# Altium schematic sheet coverSheet.SchDoc
size 431 x 279 mm; Date: Not shown in title block; ApprovedBy: Not shown in title block; CheckedBy: Not shown in title block; Author: Not shown in title block; CompanyName: Not shown in title block; Engineer: Not shown in title block; Organization: Not shown in title block; Address1: Not shown in title block; Address2: Not shown in title block; Address3: Not shown in title block; Address4: Not shown in title block; DocumentNumber: 1; Revision: Use project parameter SCH_Rev; SheetNumber: 1; SheetTotal: 3; PageSetup: Record=PageOptions|CenterHorizontal=True|CenterVertical=True|PrintScale=1.00|XCorrection=1.00|YCorrection=1.00|PrintKind=0|BorderSize=5000000|LeftOffset=0|BottomOffset=0|Orientation=2|PaperLength=1000|PaperWidth=1000|Scale=100|PaperSource=15|PrintQuality=600|MediaType=1|DitherType=10|PaperKind=Letter|PrintScaleMode=1; CurrentTime: Not shown in title block; CurrentDate: Not shown in title block; Time: Not shown in title block; DocumentFullPathAndName: Not shown in title block; DocumentName: Not shown in title block; ModifiedDate: Not shown in title block; ImagePath: Not shown in title block
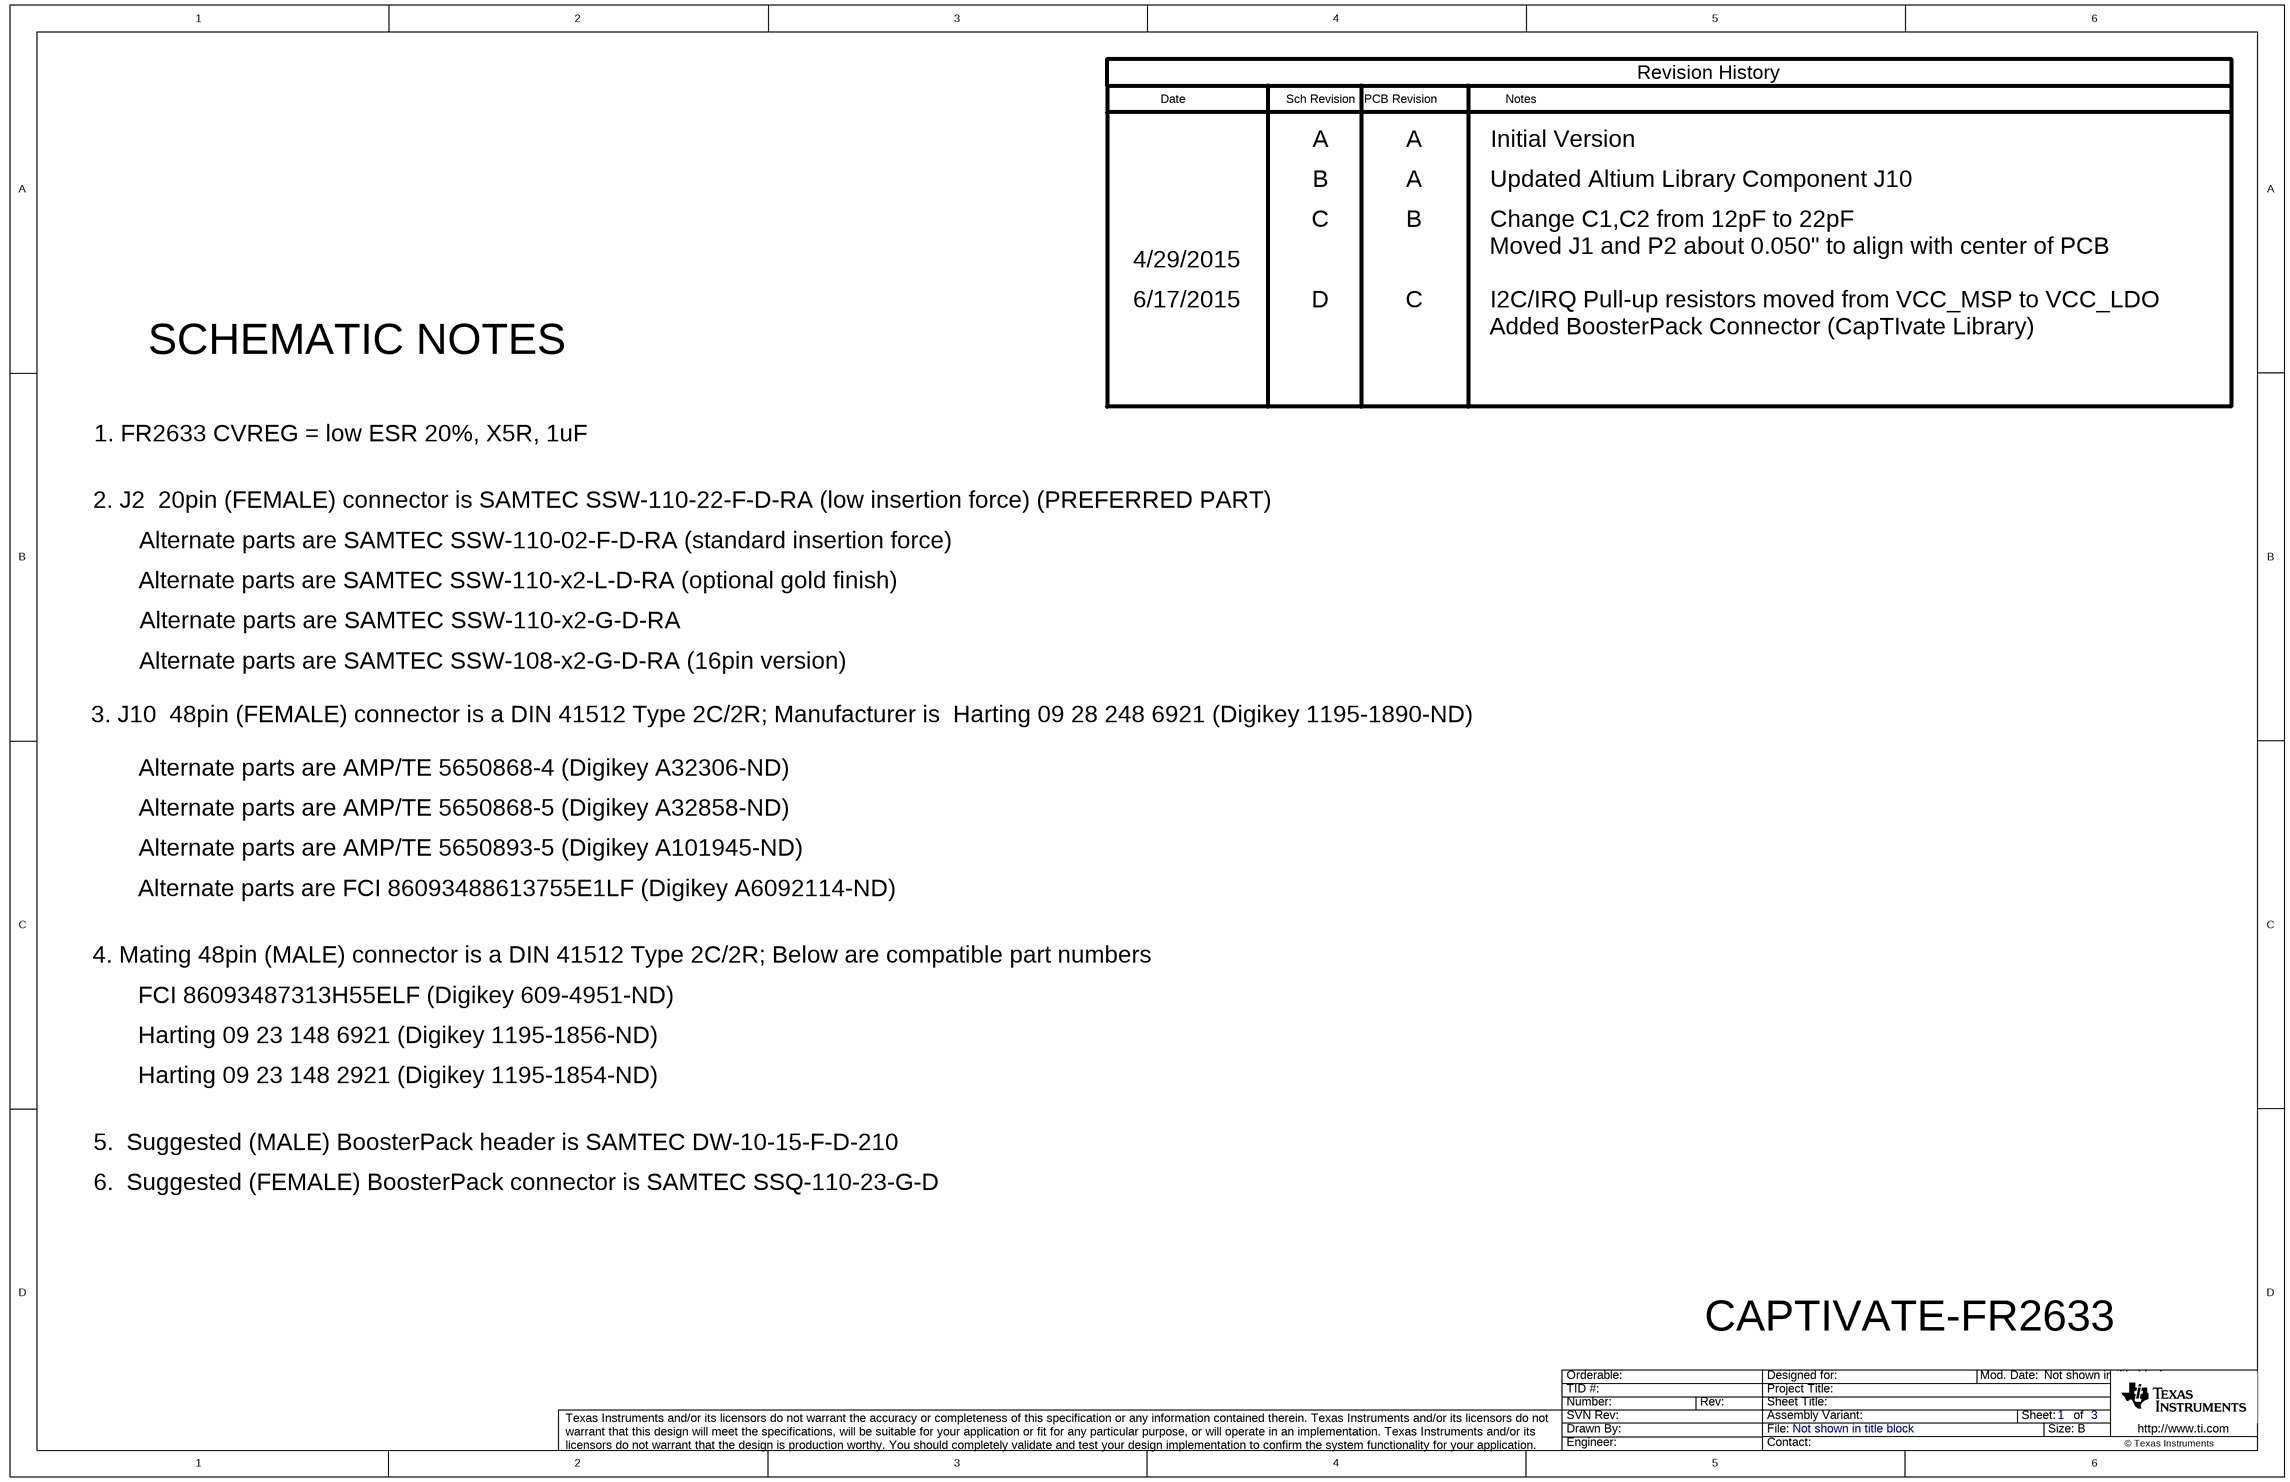
[diagram p0: coverSheet.SchDoc]

## Notes on the sheet
- Date
- Sch Revision
- PCB Revision
- Notes
- Revision History
- A
- Initial Version
- C
- B
- Change C1,C2 from 12pF to 22pF
- Updated Altium Library Component J10
- 6/17/2015
- 4/29/2015
- D
- Moved J1 and P2 about 0.050" to align with center of PCB
- I2C/IRQ Pull-up resistors moved from VCC_MSP to VCC_LDO
- SCHEMATIC NOTES
- Added BoosterPack Connector (CapTIvate Library)
- 1. FR2633 CVREG = low ESR 20%, X5R, 1uF
- 2. J2  20pin (FEMALE) connector is SAMTEC SSW-110-22-F-D-RA (low insertion force) (PREFERRED PART)
- Alternate parts are SAMTEC SSW-110-02-F-D-RA (standard insertion force)
- Alternate parts are SAMTEC SSW-110-x2-G-D-RA
- Alternate parts are SAMTEC SSW-110-x2-L-D-RA (optional gold finish)
- Alternate parts are SAMTEC SSW-108-x2-G-D-RA (16pin version)
- Alternate parts are AMP/TE 5650868-4 (Digikey A32306-ND)
- 3. J10  48pin (FEMALE) connector is a DIN 41512 Type 2C/2R; Manufacturer is  Harting 09 28 248 6921 (Digikey 1195-1890-ND)
- Alternate parts are AMP/TE 5650868-5 (Digikey A32858-ND)
- Alternate parts are AMP/TE 5650893-5 (Digikey A101945-ND)
- Alternate parts are FCI 86093488613755E1LF (Digikey A6092114-ND)
- 4. Mating 48pin (MALE) connector is a DIN 41512 Type 2C/2R; Below are compatible part numbers
- Harting 09 23 148 6921 (Digikey 1195-1856-ND)
- FCI 86093487313H55ELF (Digikey 609-4951-ND)
- Harting 09 23 148 2921 (Digikey 1195-1854-ND)
- 5.  Suggested (MALE) BoosterPack header is SAMTEC DW-10-15-F-D-210
- 6.  Suggested (FEMALE) BoosterPack connector is SAMTEC SSQ-110-23-G-D
- CAPTIVATE-FR2633
- Drawn By:
- SVN Rev:
- Number:
- TID #:
- Orderable:
- Rev:
- Sheet Title:
- File:
- Project Title:
- Designed for:
- Assembly Variant:
- Mod. Date:
- Sheet:
- Size:
- of
- http://www.ti.com
- Texas Instruments and/or its licensors do not warrant the accuracy or completeness of this specification or any information contained therein. Texas Instruments and/or its licensors do not warrant that this design will meet the specifications, will be suitable for your application or fit for any particular purpose, or will operate in an implementation. Texas Instruments and/or its licensors do not warrant that the design is production worthy. You should completely validate and test your design implementation to confirm the system functionality for your application.
- Engineer:
- Contact:
- © Texas Instruments